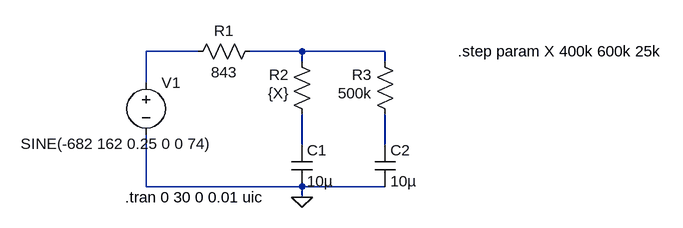
[diagram p0: schematic NormalLung.asc]
NormalLung.asc, the LTspice schematic file:
Version 4
SHEET 1 880 680
WIRE 80 80 0 80
WIRE 240 80 160 80
WIRE 368 80 240 80
WIRE 240 96 240 80
WIRE 368 96 368 80
WIRE 0 128 0 80
WIRE 240 224 240 176
WIRE 368 224 368 176
WIRE 0 288 0 208
WIRE 240 288 0 288
WIRE 368 288 240 288
WIRE 240 304 240 288
FLAG 240 304 0
SYMBOL voltage 0 112 R0
WINDOW 3 -193 110 Left 2
WINDOW 123 24 124 Left 2
WINDOW 39 0 0 Left 0
SYMATTR Value SINE(-682 162 0.25 0 0 74)
SYMATTR InstName V1
SYMBOL res 176 64 R90
WINDOW 0 0 56 VBottom 2
WINDOW 3 32 56 VTop 2
SYMATTR InstName R1
SYMATTR Value 843
SYMBOL res 256 192 R180
WINDOW 0 36 76 Left 2
WINDOW 3 36 48 Left 2
SYMATTR InstName R2
SYMATTR Value {X}
SYMBOL res 384 192 R180
WINDOW 0 36 76 Left 2
WINDOW 3 36 48 Left 2
SYMATTR InstName R3
SYMATTR Value 500k
SYMBOL cap 224 224 R0
SYMATTR InstName C1
SYMATTR Value 10µ
SYMBOL cap 352 224 R0
SYMATTR InstName C2
SYMATTR Value 10µ
TEXT -32 304 Left 2 !.tran 0 30 0 0.01 uic
TEXT 480 80 Left 2 !.step param X 400k 600k 25k

The netlist it stands for:
* NormalLung.asc
V1 N001 0 SINE(-682 162 0.25 0 0 74)
R1 N002 N001 843
R2 N003 N002 {X}
R3 N004 N002 500k
C1 N003 0 10µ
C2 N004 0 10µ
.tran 0 30 0 0.01 uic
.step param X 400k 600k 25k
.backanno
.end